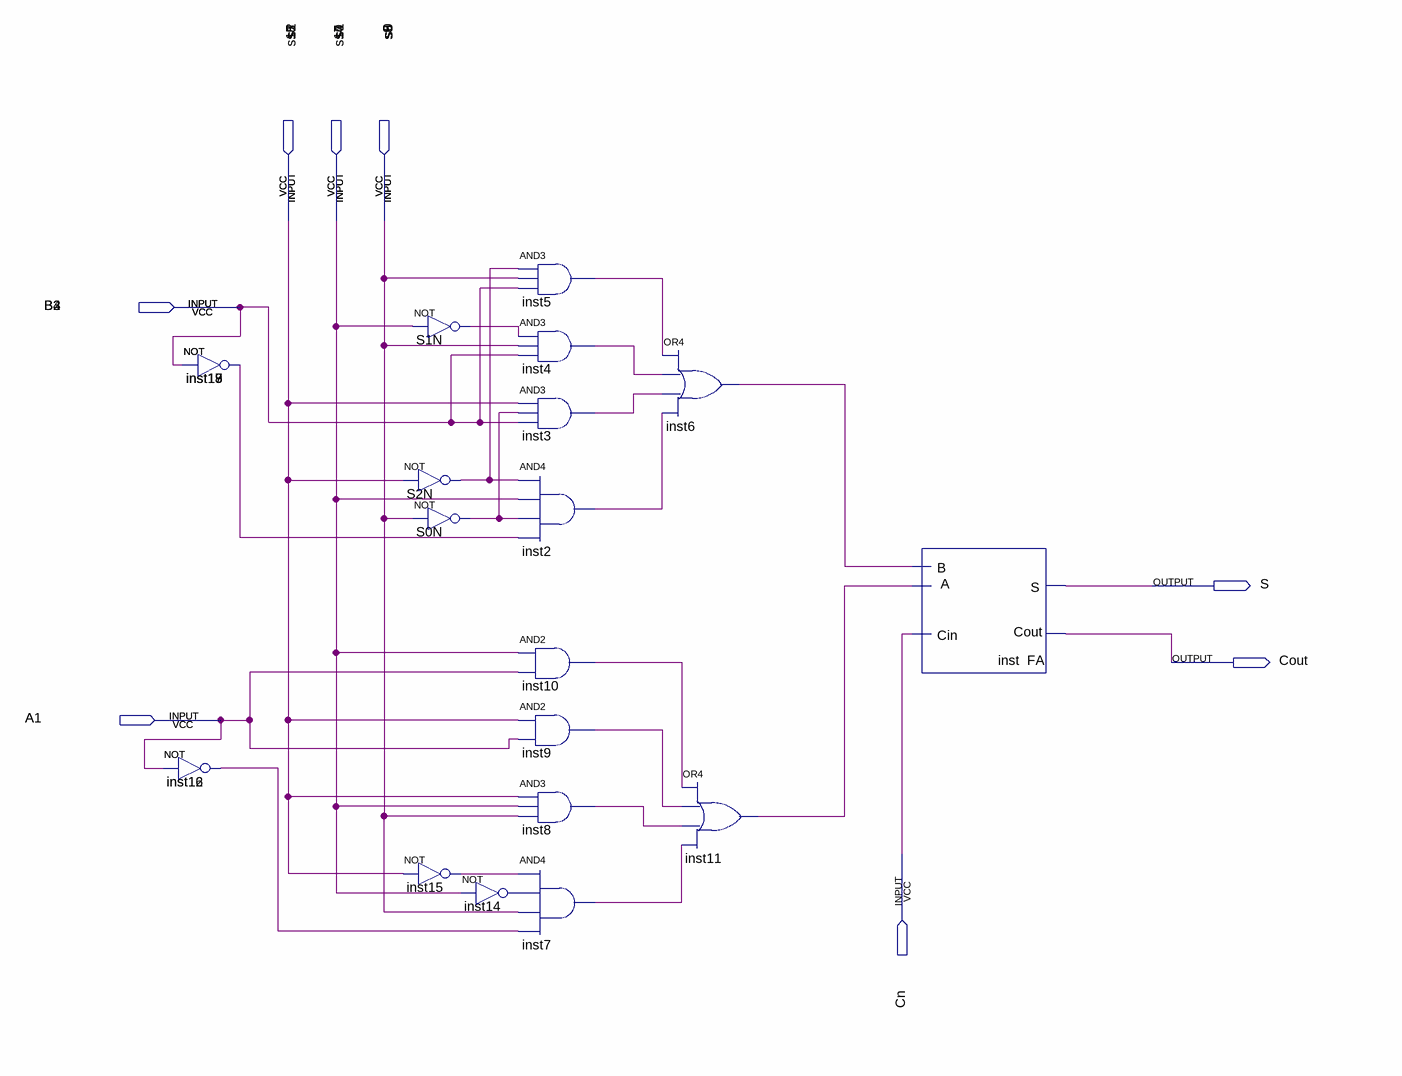
[diagram p0: schematic sheet]
// Quartus schematic test.bdf as structural Verilog: 22 symbols, 21 pins
module test (
  input  s2,
  input  s5,
  input  s8,
  input  s11,
  input  s1,
  input  s4,
  input  s7,
  input  s10,
  input  s0,
  input  s3,
  input  s6,
  input  s9,
  input  B,
  input  B2,
  input  B3,
  input  B4,
  input  A,
  input  A1,
  input  Cn,
  output S,
  output Cout
);

  wire inst2_out, inst3_out, inst4_out, inst5_out, inst6_out, inst7_out, inst8_out, inst9_out, inst10_out,
       inst11_out, inst12_out, inst13_out, inst14_out, inst15_out, S0N_out, S1N_out, S2N_out;

  not inst13 (inst13_out, B);
  not inst17 (inst13_out, B);
  not inst18 (inst13_out, B);
  not inst19 (inst13_out, B);
  not inst12 (inst12_out, A);
  not inst16 (inst12_out, A);
  not S1N (S1N_out, s1);
  not S2N (S2N_out, s2);
  not S0N (S0N_out, s0);
  not inst15 (inst15_out, s2);
  and inst5 (inst5_out, S2N_out, s0, B);
  and inst4 (inst4_out, S1N_out, s0, B);
  and inst3 (inst3_out, s2, S0N_out, B);
  and inst2 (inst2_out, S2N_out, s1, S0N_out, inst13_out);
  and inst10 (inst10_out, s1, A);
  and inst9 (inst9_out, s2, A);
  and inst8 (inst8_out, s2, s1, s0);
  and inst7 (inst7_out, inst15_out, inst14_out, s0, inst12_out);
  not inst14 (inst14_out, s1);
  or inst6 (inst6_out, inst5_out, inst4_out, inst3_out, inst2_out);
  or inst11 (inst11_out, inst10_out, inst9_out, inst8_out, inst7_out);
  FA inst (.A(inst11_out), .B(inst6_out), .Cin(Cn), .S(S), .Cout(Cout));

  assign A1 = A;
  assign B2 = B;
  assign B3 = B;
  assign B4 = B;
  assign s3 = s0;
  assign s4 = s1;
  assign s5 = s2;
  assign s6 = s0;
  assign s7 = s1;
  assign s8 = s2;
  assign s9 = s0;
  assign s10 = s1;
  assign s11 = s2;
endmodule
